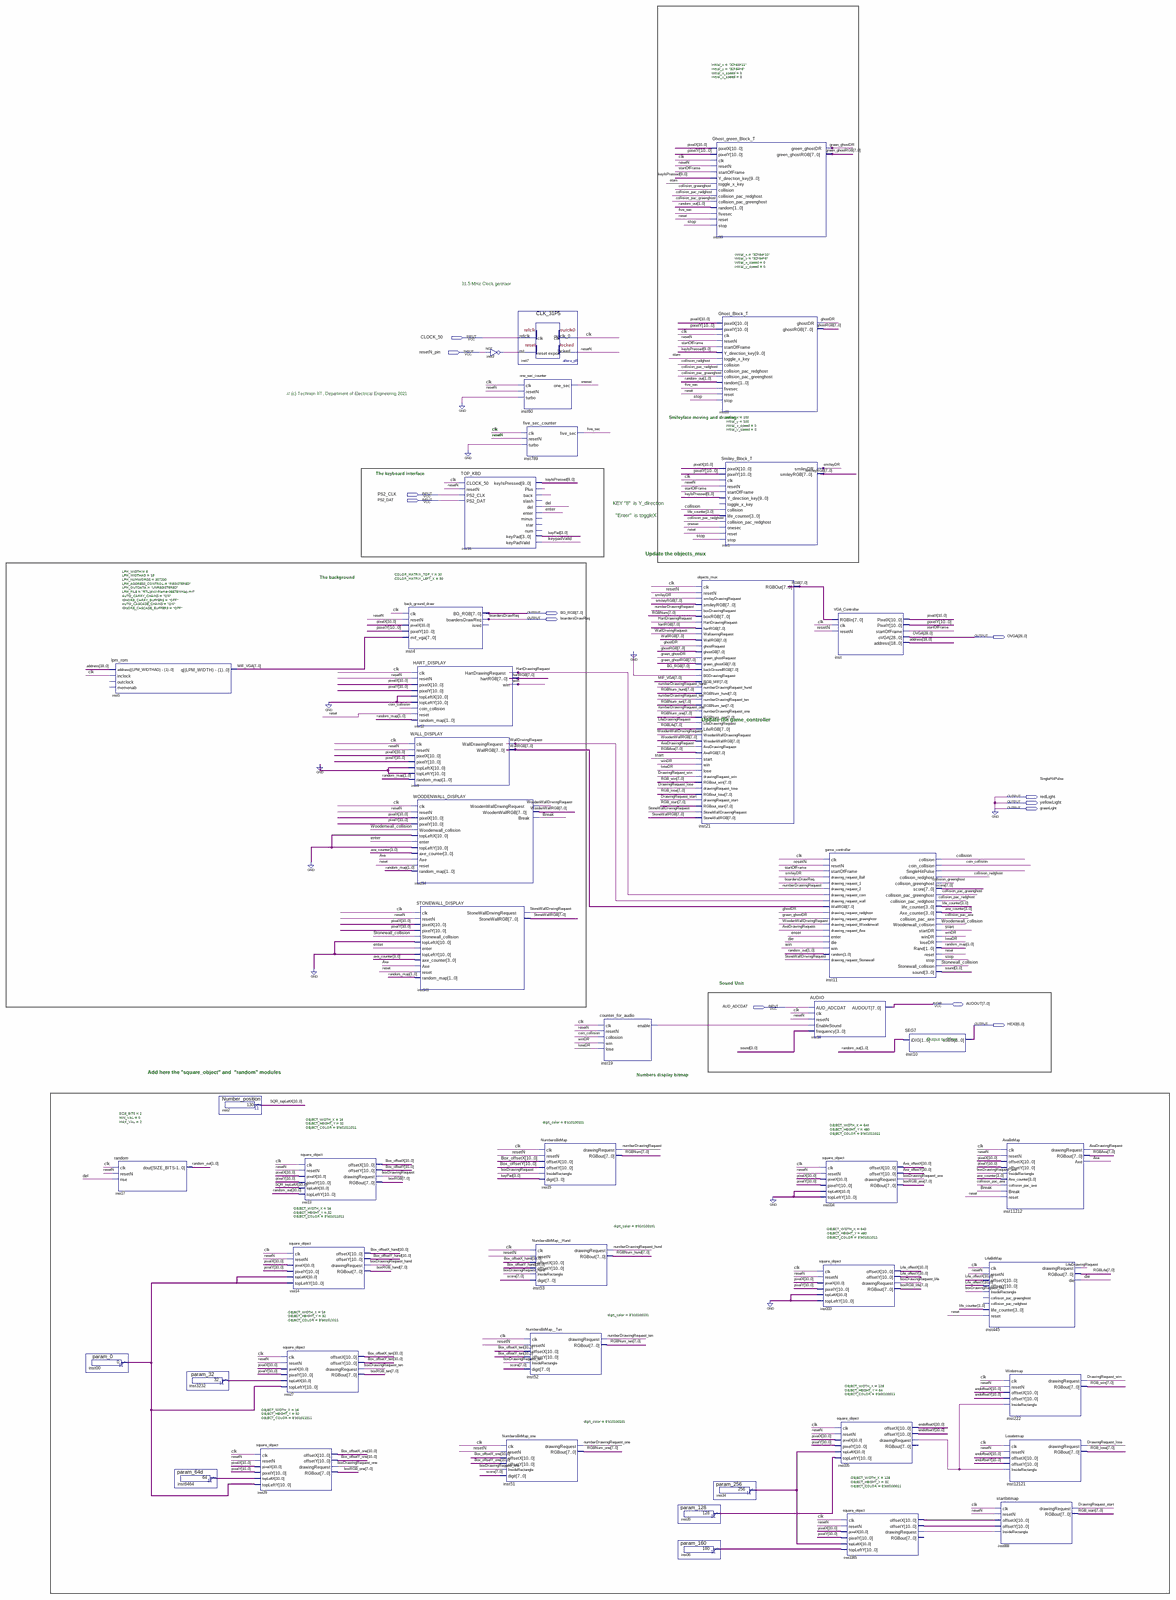
[diagram p0: schematic sheet, whole]
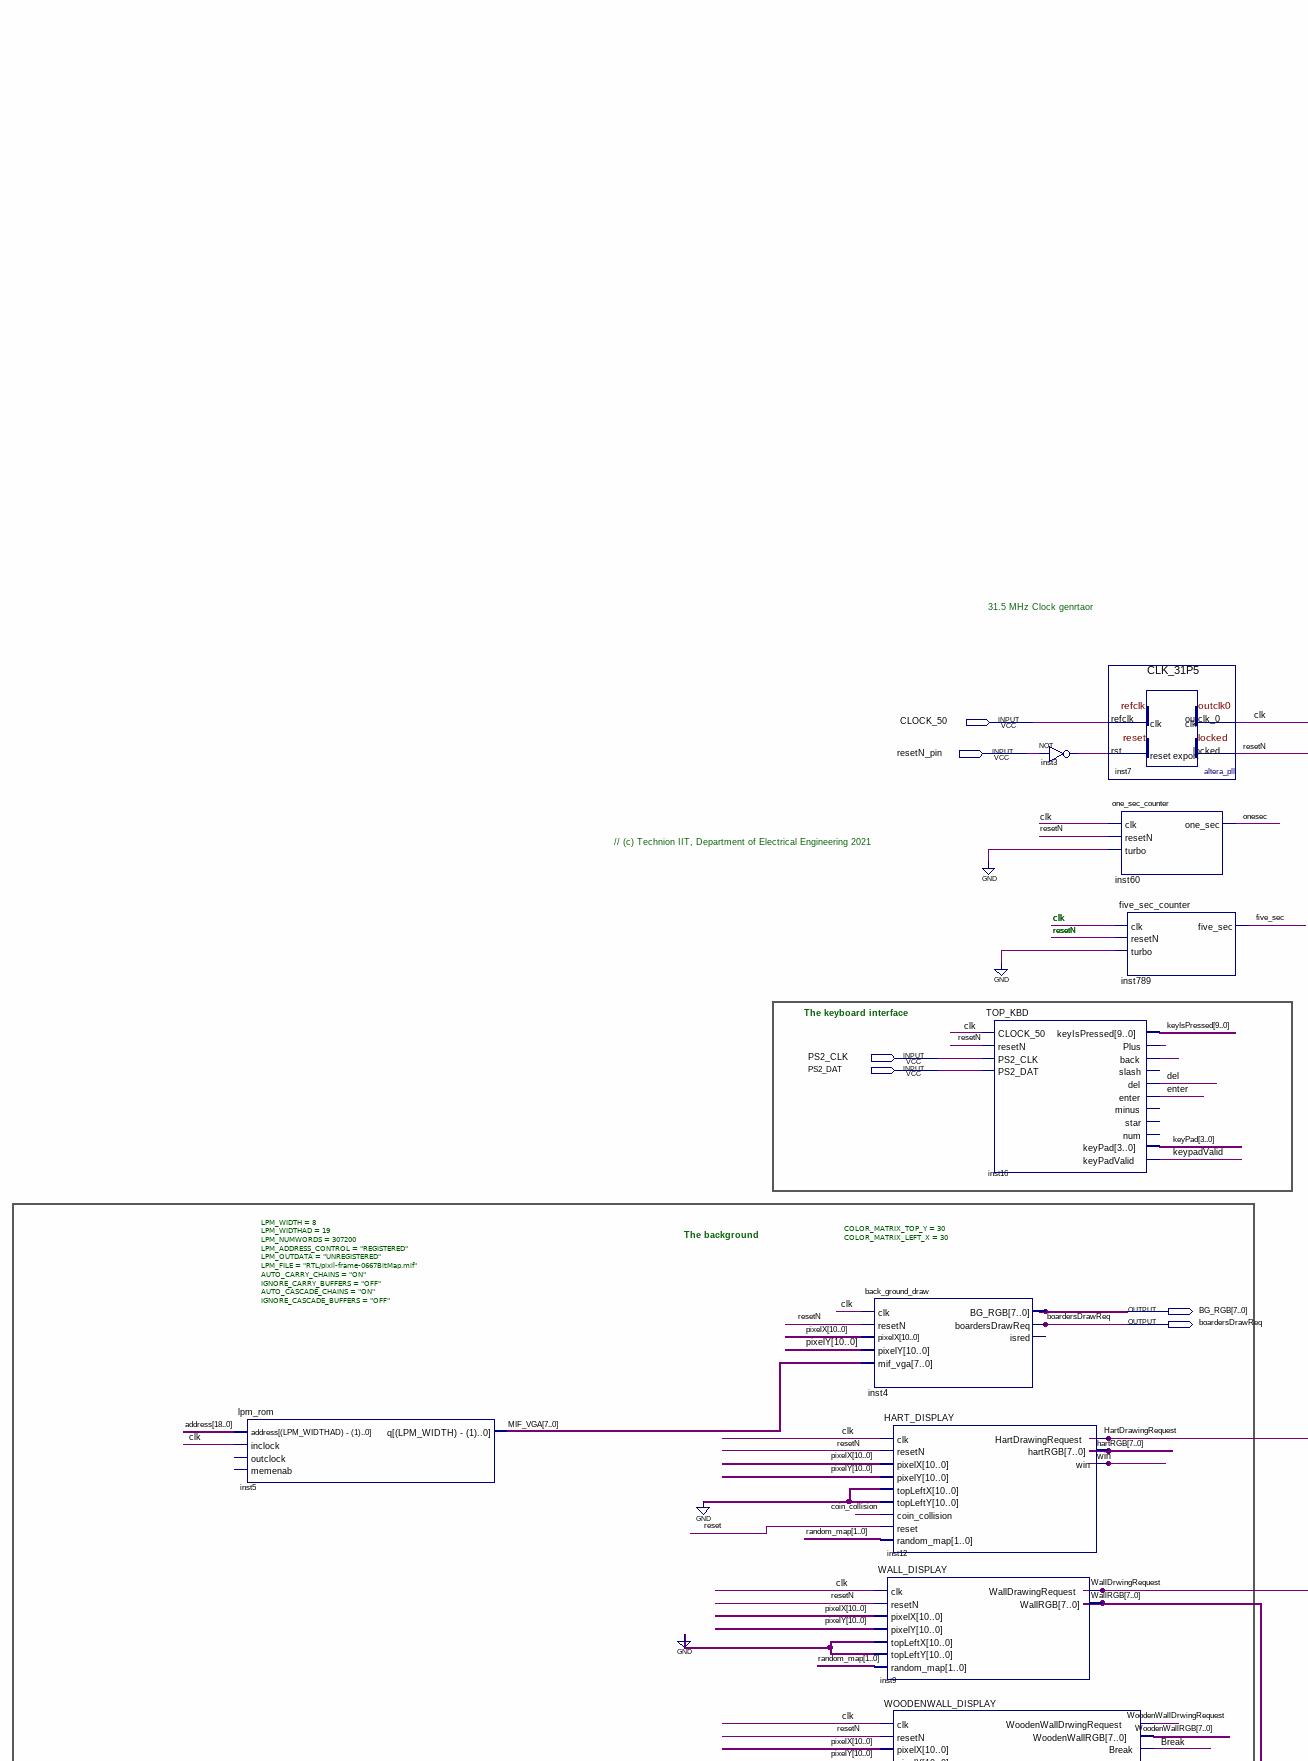
[diagram p1: schematic sheet, upper left part]
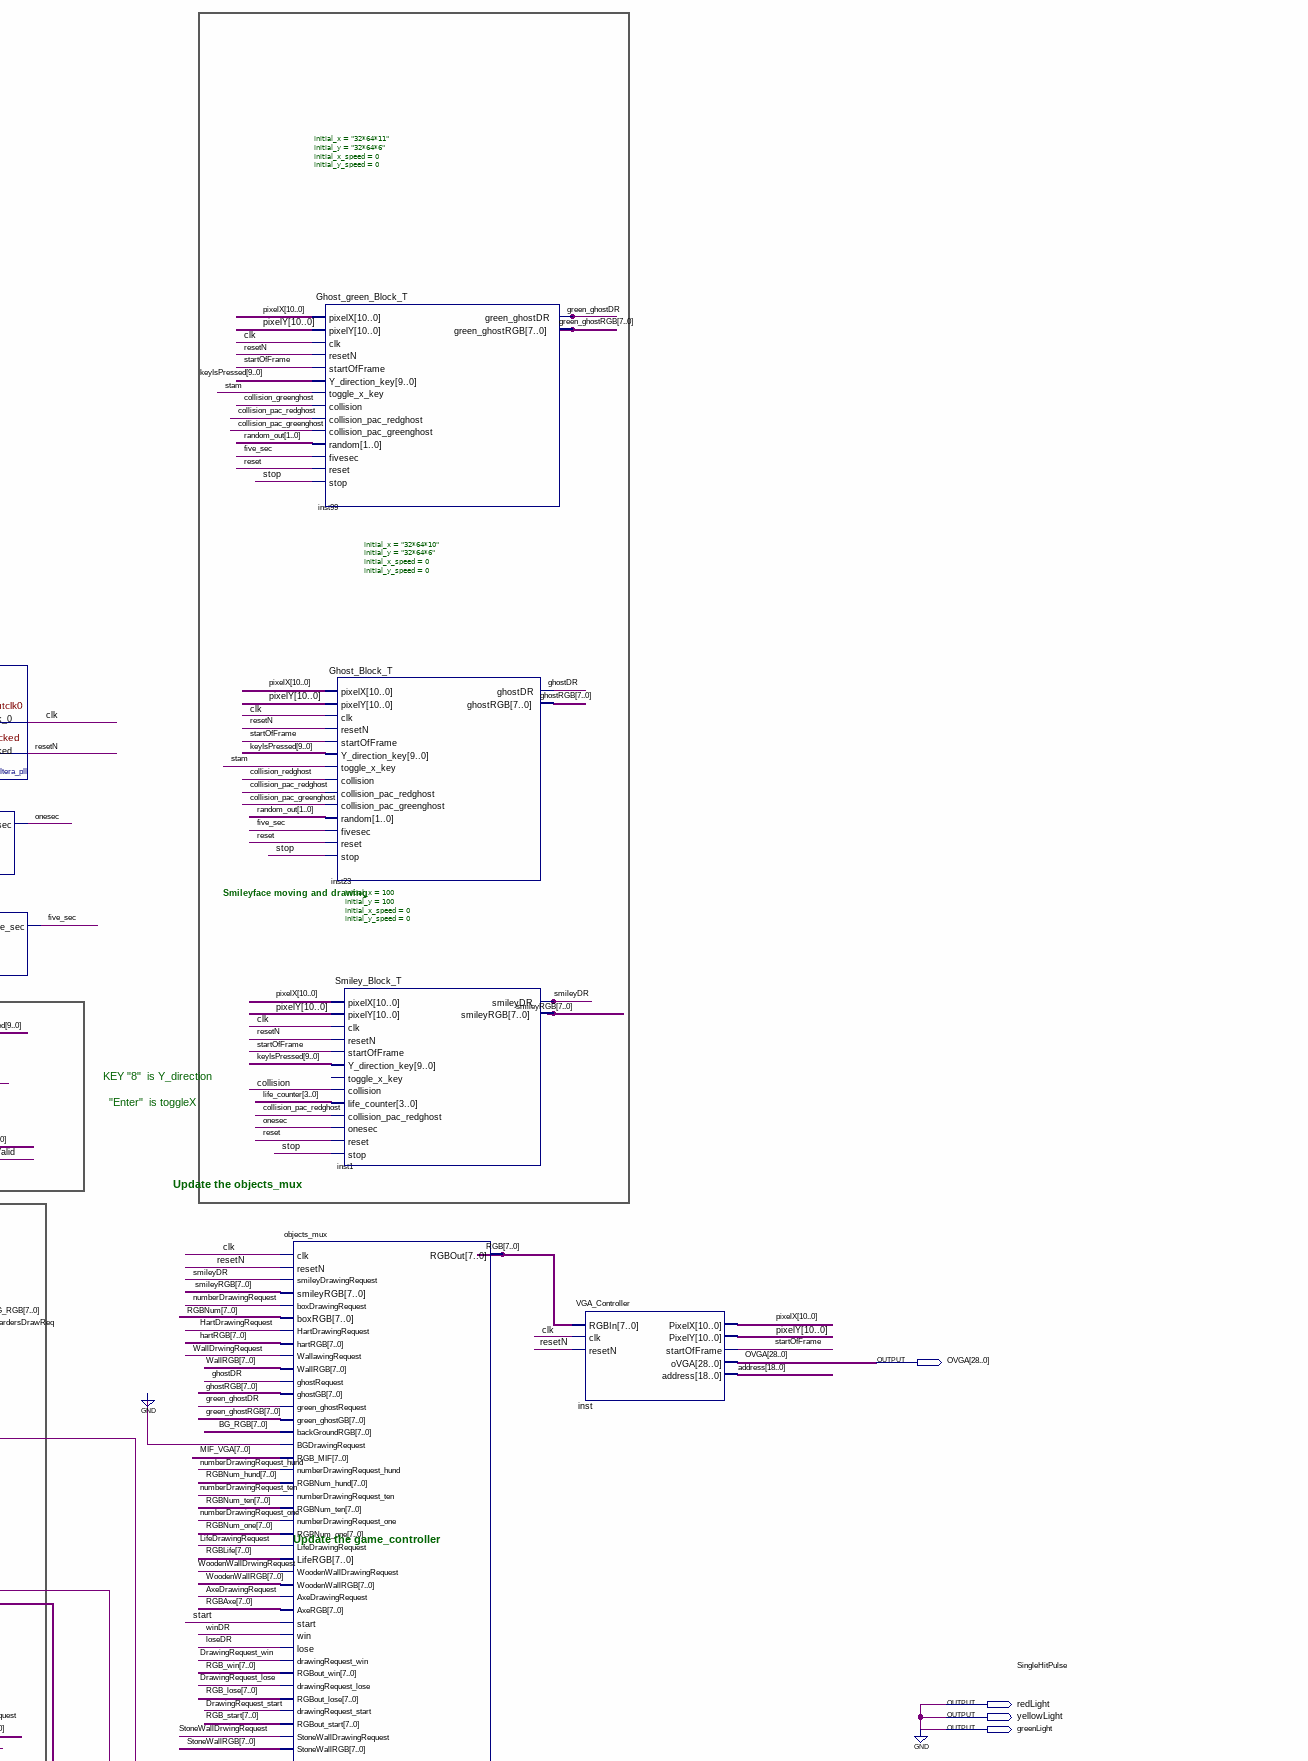
[diagram p2: schematic sheet, upper right part]
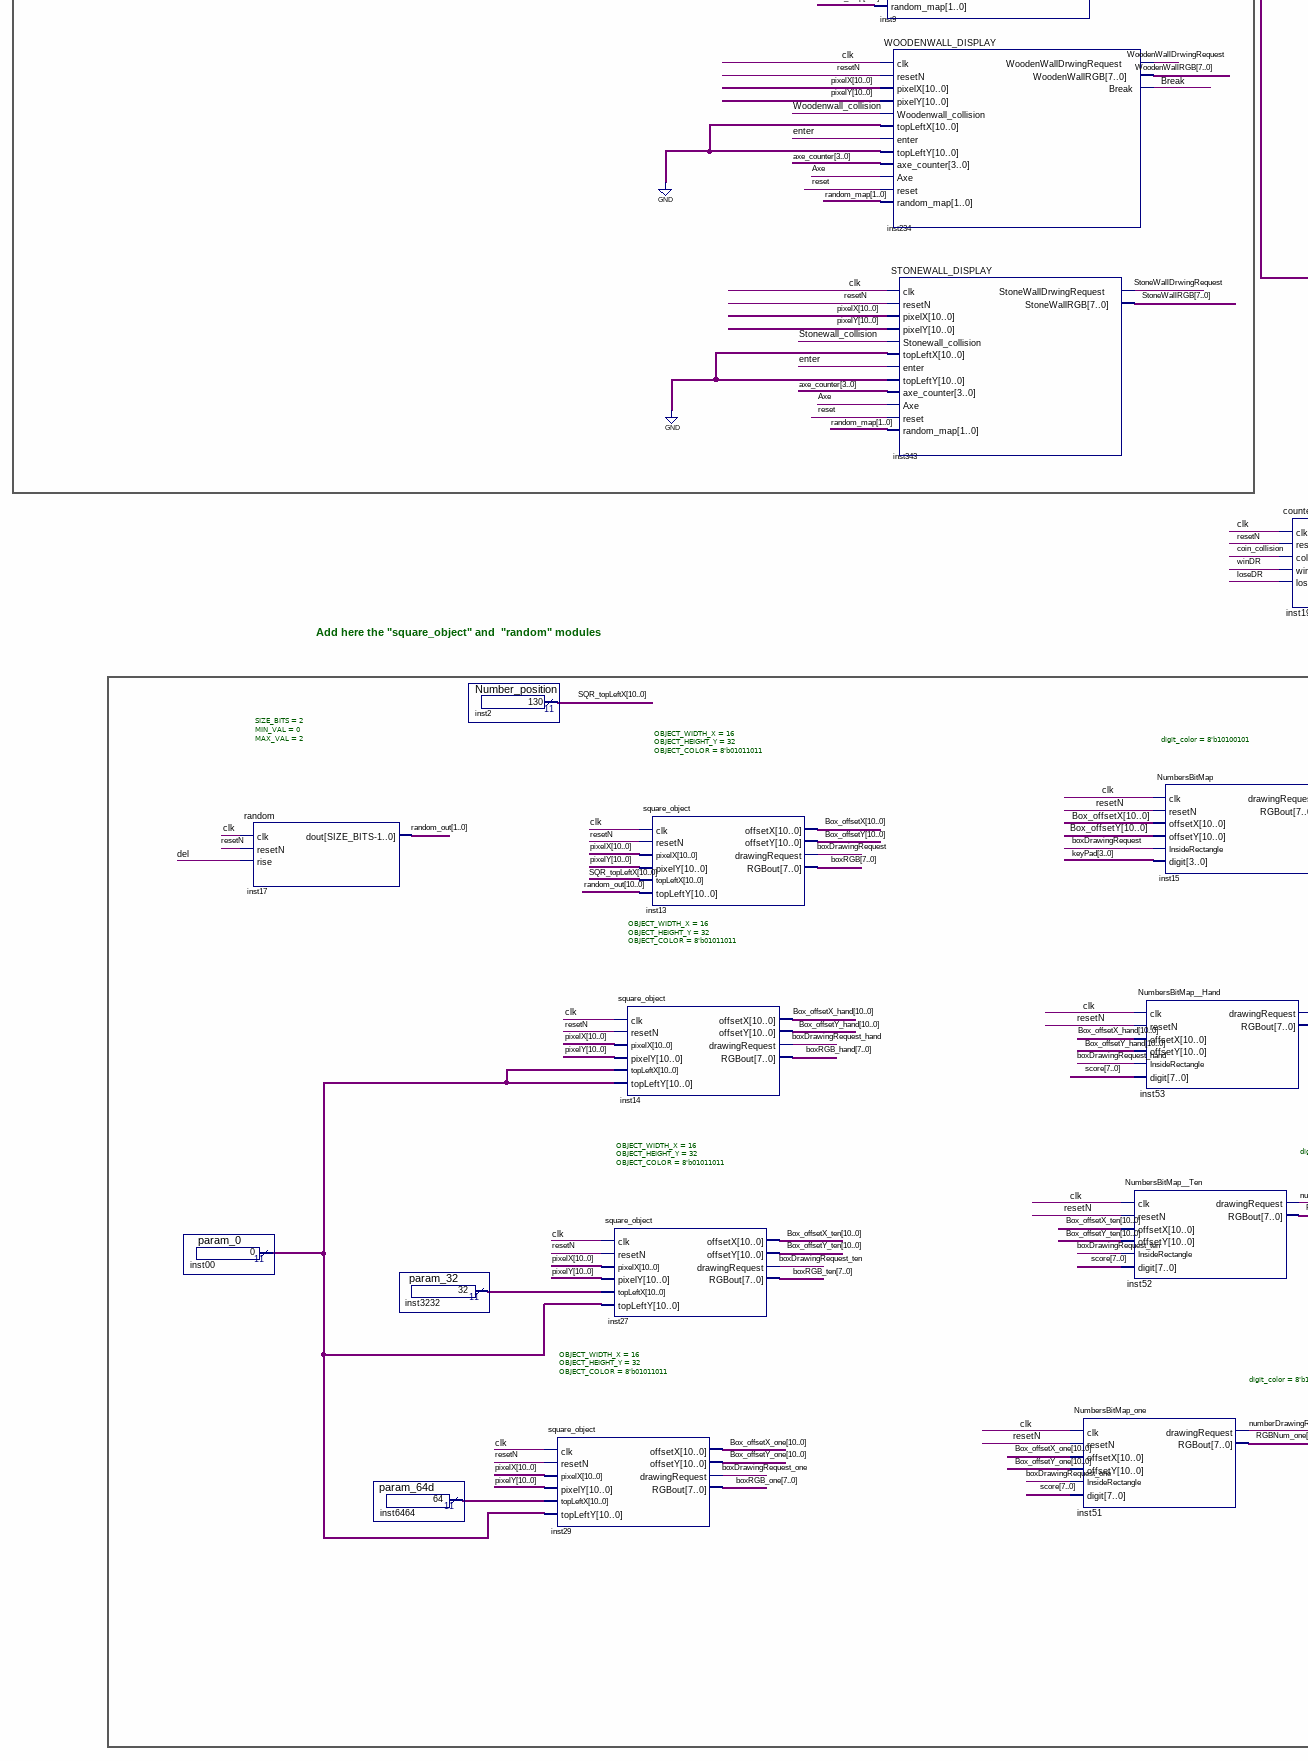
[diagram p3: schematic sheet, lower left part]
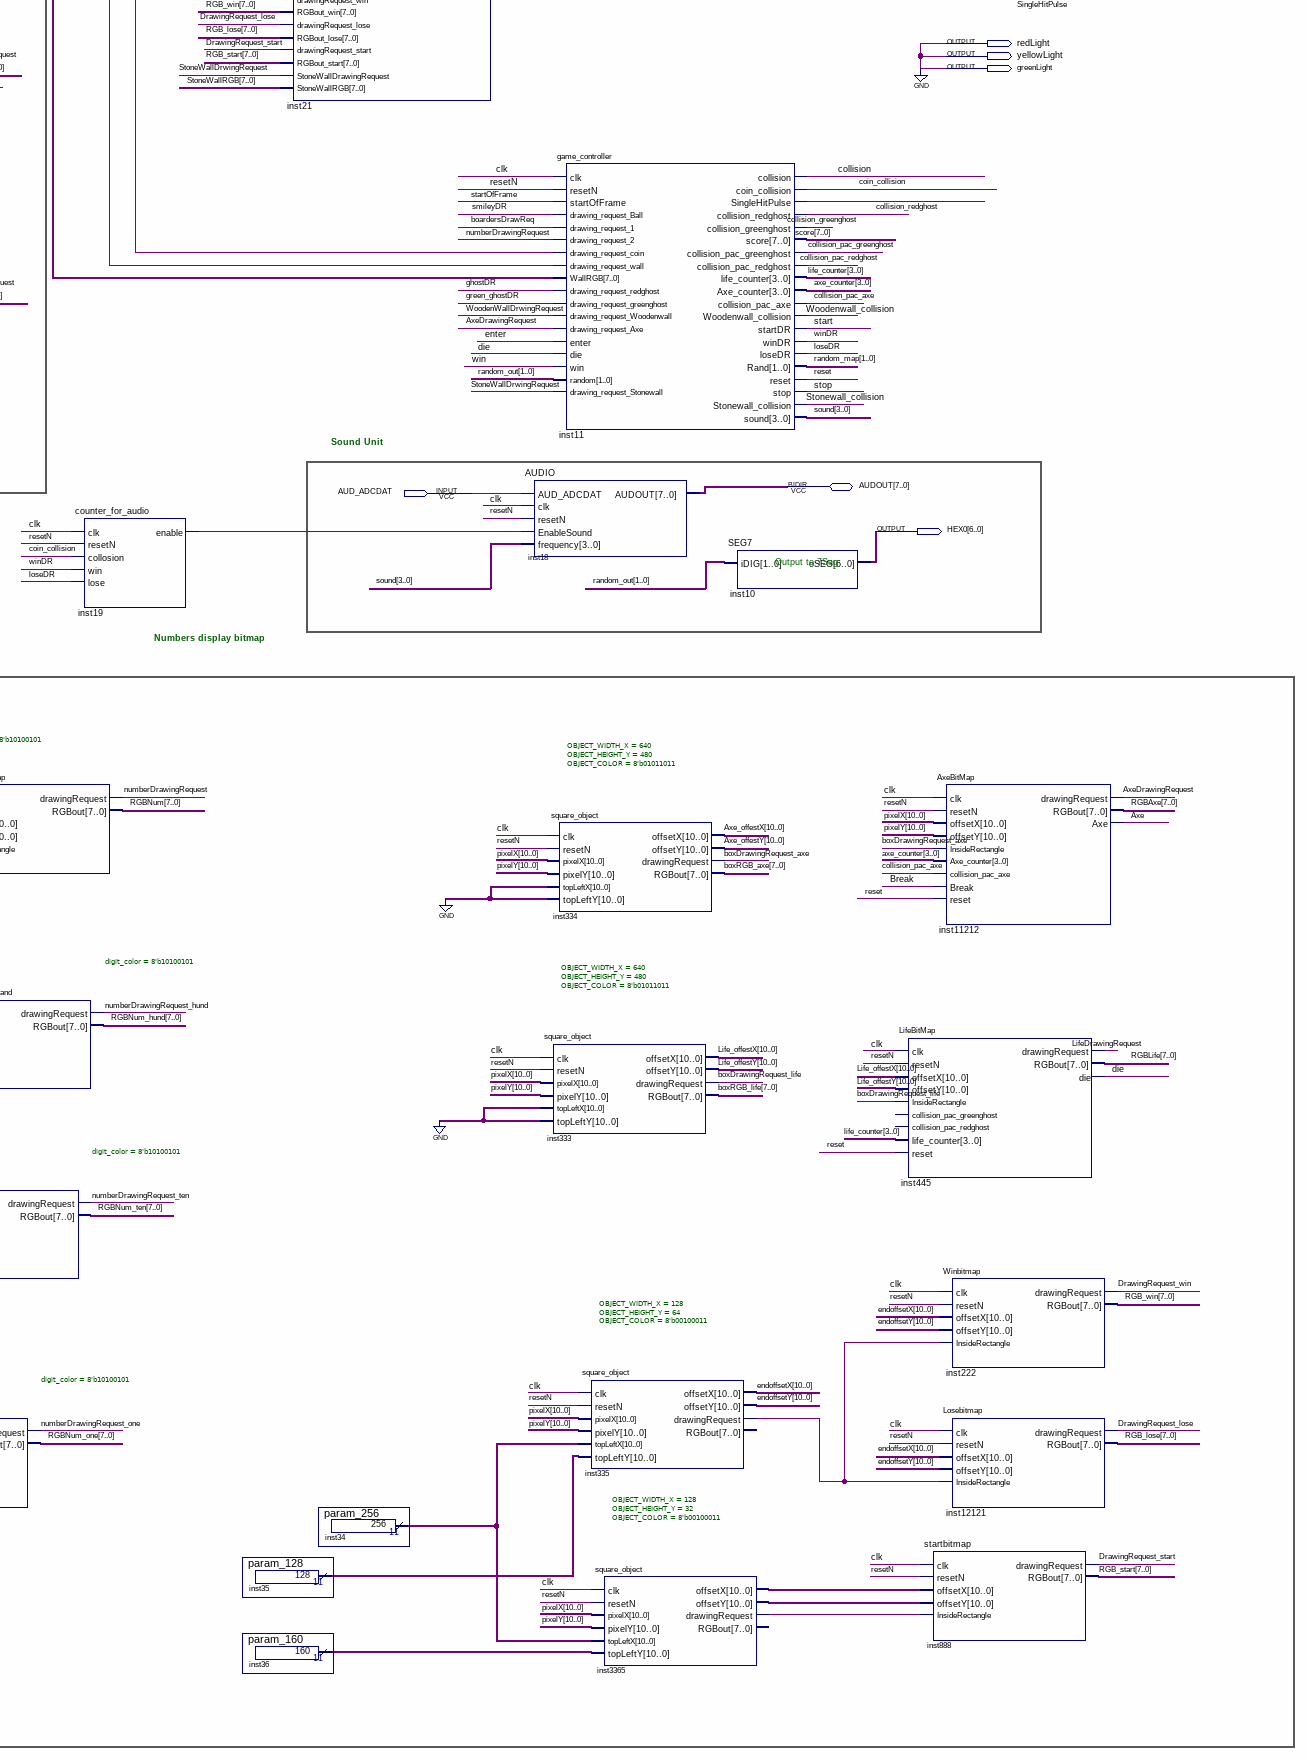
[diagram p4: schematic sheet, lower right part]
// Quartus schematic TOP_VGA_DEMO_KBD.bdf as structural Verilog: 45 symbols, 13 pins
module TOP_VGA_DEMO_KBD (
  input  CLOCK_50,
  input  resetN_pin,
  input  PS2_CLK,
  input  PS2_DAT,
  input  AUD_ADCDAT,
  inout  [7:0] AUDOUT,
  output [7:0] BG_RGB,
  output boardersDrawReq,
  output [28:0] OVGA,
  output redLight,
  output yellowLight,
  output greenLight,
  output [6:0] HEX0
);

  wire Axe, AxeDrawingRequest, boxDrawingRequest, boxDrawingRequest_axe, boxDrawingRequest_hand,
       boxDrawingRequest_life, boxDrawingRequest_one, boxDrawingRequest_ten, Break, clk, coin_collision,
       collision, collision_greenghost, collision_pac_axe, collision_pac_greenghost, collision_pac_redghost,
       collision_redghost, del, die, DrawingRequest_lose, DrawingRequest_start, DrawingRequest_win, enter,
       five_sec, ghostDR, green_ghostDR, HartDrawingRequest, inst3_out, inst16_back, inst16_plus,
       inst19_enable, inst335_drawingrequest, inst3365_drawingrequest, keypadValid, LifeDrawingRequest,
       loseDR, numberDrawingRequest, numberDrawingRequest_hund, numberDrawingRequest_one,
       numberDrawingRequest_ten, onesec, reset, resetN, SingleHitPulse, smileyDR, stam, start, startOfFrame,
       Stonewall_collision, StoneWallDrwingRequest, stop, WallDrwingRequest, win, winDR,
       Woodenwall_collision, WoodenWallDrwingRequest;
  wire [1:0] random_map;
  wire [3:0] axe_counter, keyPad, life_counter, sound;
  wire [7:0] boxRGB, boxRGB_axe, boxRGB_hand, boxRGB_life, boxRGB_one, boxRGB_ten, ghostRGB, green_ghostRGB,
       hartRGB, MIF_VGA, RGB, RGB_lose, RGB_start, RGB_win, RGBAxe, RGBLife, RGBNum, RGBNum_hund, RGBNum_one,
       RGBNum_ten, score, smileyRGB, StoneWallRGB, WallRGB, WoodenWallRGB;
  wire [9:0] keyIsPressed;
  wire [10:0] Axe_offestX, Axe_offestY, Box_offsetX, Box_offsetX_hand, Box_offsetX_one, Box_offsetX_ten,
       Box_offsetY, Box_offsetY_hand, Box_offsetY_one, Box_offsetY_ten, endoffsetX, endoffsetY,
       inst00_result, inst34_result, inst35_result, inst36_result, inst3232_result, inst3365_offsetx,
       inst3365_offsety, inst6464_result, Life_offestX, Life_offestY, pixelX, pixelY, random_out,
       SQR_topLeftX;
  wire [18:0] address;

  param_0 inst00 (.result(inst00_result));
  lpm_rom #(.LPM_WIDTH(8), .LPM_WIDTHAD(19), .LPM_NUMWORDS(307200), .LPM_ADDRESS_CONTROL("REGISTERED"), .LPM_OUTDATA("UNREGISTERED"), .LPM_FILE("RTL/pixil-frame-0667BitMap.mif"), .AUTO_CARRY_CHAINS("ON"), .IGNORE_CARRY_BUFFERS("OFF"), .AUTO_CASCADE_CHAINS("ON"), .IGNORE_CASCADE_BUFFERS("OFF")) inst5 (
    .address(address), .inclock(clk), .q(MIF_VGA));  // open: outclock, memenab
  random #(.SIZE_BITS(2), .MIN_VAL(0), .MAX_VAL(2)) inst17 (
    .clk(clk), .resetN(resetN), .rise(del), .dout(random_out[1:0]));
  param_32 inst3232 (.result(inst3232_result));
  param_64d inst6464 (.result(inst6464_result));
  Number_position inst2 (.result(SQR_topLeftX));
  square_object #(.OBJECT_WIDTH_X(16), .OBJECT_HEIGHT_Y(32), .OBJECT_COLOR(8'b01011011)) inst29 (
    .clk(clk), .resetN(resetN), .pixelX(pixelX), .pixelY(pixelY), .topLeftX(inst6464_result),
    .topLeftY(inst00_result), .offsetX(Box_offsetX_one), .offsetY(Box_offsetY_one),
    .drawingRequest(boxDrawingRequest_one), .RGBout(boxRGB_one));
  square_object #(.OBJECT_WIDTH_X(16), .OBJECT_HEIGHT_Y(32), .OBJECT_COLOR(8'b01011011)) inst27 (
    .clk(clk), .resetN(resetN), .pixelX(pixelX), .pixelY(pixelY), .topLeftX(inst3232_result),
    .topLeftY(inst00_result), .offsetX(Box_offsetX_ten), .offsetY(Box_offsetY_ten),
    .drawingRequest(boxDrawingRequest_ten), .RGBout(boxRGB_ten));
  square_object #(.OBJECT_WIDTH_X(16), .OBJECT_HEIGHT_Y(32), .OBJECT_COLOR(8'b01011011)) inst13 (
    .clk(clk), .resetN(resetN), .pixelX(pixelX), .pixelY(pixelY), .topLeftX(SQR_topLeftX),
    .topLeftY(random_out), .offsetX(Box_offsetX), .offsetY(Box_offsetY), .drawingRequest(boxDrawingRequest),
    .RGBout(boxRGB));
  square_object #(.OBJECT_WIDTH_X(16), .OBJECT_HEIGHT_Y(32), .OBJECT_COLOR(8'b01011011)) inst14 (
    .clk(clk), .resetN(resetN), .pixelX(pixelX), .pixelY(pixelY), .topLeftX(inst00_result),
    .topLeftY(inst00_result), .offsetX(Box_offsetX_hand), .offsetY(Box_offsetY_hand),
    .drawingRequest(boxDrawingRequest_hand), .RGBout(boxRGB_hand));
  back_ground_draw #(.COLOR_MATRIX_TOP_Y(30), .COLOR_MATRIX_LEFT_X(30)) inst4 (
    .clk(clk), .resetN(resetN), .pixelX(pixelX), .pixelY(pixelY), .mif_vga(MIF_VGA), .BG_RGB(BG_RGB),
    .boardersDrawReq(boardersDrawReq));  // open: isred
  HART_DISPLAY inst12 (
    .clk(clk), .resetN(resetN), .pixelX(pixelX), .pixelY(pixelY), .topLeftX({11{1'b0}}),
    .topLeftY({11{1'b0}}), .coin_collision(coin_collision), .reset(reset), .random_map(random_map),
    .HartDrawingRequest(HartDrawingRequest), .hartRGB(hartRGB), .win(win));
  WALL_DISPLAY inst9 (
    .clk(clk), .resetN(resetN), .pixelX(pixelX), .pixelY(pixelY), .topLeftX({11{1'b0}}),
    .topLeftY({11{1'b0}}), .random_map(random_map), .WallDrawingRequest(WallDrwingRequest), .WallRGB(WallRGB));
  WOODENWALL_DISPLAY inst234 (
    .clk(clk), .resetN(resetN), .pixelX(pixelX), .pixelY(pixelY),
    .Woodenwall_collision(Woodenwall_collision), .topLeftX({11{1'b0}}), .enter(enter), .topLeftY({11{1'b0}}),
    .axe_counter(axe_counter), .Axe(Axe), .reset(reset), .random_map(random_map),
    .WoodenWallDrwingRequest(WoodenWallDrwingRequest), .WoodenWallRGB(WoodenWallRGB), .Break(Break));
  STONEWALL_DISPLAY inst343 (
    .clk(clk), .resetN(resetN), .pixelX(pixelX), .pixelY(pixelY), .Stonewall_collision(Stonewall_collision),
    .topLeftX({11{1'b0}}), .enter(enter), .topLeftY({11{1'b0}}), .axe_counter(axe_counter), .Axe(Axe),
    .reset(reset), .random_map(random_map), .StoneWallDrwingRequest(StoneWallDrwingRequest),
    .StoneWallRGB(StoneWallRGB));
  TOP_KBD inst16 (
    .CLOCK_50(clk), .resetN(resetN), .PS2_CLK(PS2_CLK), .PS2_DAT(PS2_DAT), .keyIsPressed(keyIsPressed),
    .Plus(inst16_plus), .back(inst16_back), .del(del), .enter(enter), .keyPad(keyPad),
    .keyPadValid(keypadValid));  // open: slash, minus, star, num
  not inst3 (inst3_out, resetN_pin);
  CLK_31P5 inst7 (.refclk(CLOCK_50), .rst(inst3_out), .outclk_0(clk), .locked(resetN));
  one_sec_counter inst60 (.clk(clk), .resetN(resetN), .turbo(1'b0), .one_sec(onesec));
  NumbersBitMap_one #(.digit_color(8'b10100101)) inst51 (
    .clk(clk), .resetN(resetN), .offsetX(Box_offsetX_one), .offsetY(Box_offsetY_one),
    .InsideRectangle(boxDrawingRequest_one), .digit(score), .drawingRequest(numberDrawingRequest_one),
    .RGBout(RGBNum_one));
  five_sec_counter inst789 (.clk(clk), .resetN(resetN), .turbo(1'b0), .five_sec(five_sec));
  NumbersBitMap #(.digit_color(8'b10100101)) inst15 (
    .clk(clk), .resetN(resetN), .offsetX(Box_offsetX), .offsetY(Box_offsetY),
    .InsideRectangle(boxDrawingRequest), .digit(keyPad), .drawingRequest(numberDrawingRequest),
    .RGBout(RGBNum));
  NumbersBitMap__Hand #(.digit_color(8'b10100101)) inst53 (
    .clk(clk), .resetN(resetN), .offsetX(Box_offsetX_hand), .offsetY(Box_offsetY_hand),
    .InsideRectangle(boxDrawingRequest_hand), .digit(score), .drawingRequest(numberDrawingRequest_hund),
    .RGBout(RGBNum_hund));
  NumbersBitMap__Ten #(.digit_color(8'b10100101)) inst52 (
    .clk(clk), .resetN(resetN), .offsetX(Box_offsetX_ten), .offsetY(Box_offsetY_ten),
    .InsideRectangle(boxDrawingRequest_ten), .digit(score), .drawingRequest(numberDrawingRequest_ten),
    .RGBout(RGBNum_ten));
  counter_for_audio inst19 (
    .clk(clk), .resetN(resetN), .collosion(coin_collision), .win(winDR), .lose(loseDR), .enable(inst19_enable));
  param_128 inst35 (.result(inst35_result));
  param_160 inst36 (.result(inst36_result));
  objects_mux inst21 (
    .clk(clk), .resetN(resetN), .smileyDrawingRequest(smileyDR), .smileyRGB(smileyRGB),
    .boxDrawingRequest(numberDrawingRequest), .boxRGB(RGBNum), .HartDrawingRequest(HartDrawingRequest),
    .hartRGB(hartRGB), .WallawingRequest(WallDrwingRequest), .WallRGB(WallRGB), .ghostRequest(ghostDR),
    .ghostGB(ghostRGB), .green_ghostRequest(green_ghostDR), .green_ghostGB(green_ghostRGB),
    .backGroundRGB(BG_RGB), .BGDrawingRequest(1'b0), .RGB_MIF(MIF_VGA),
    .numberDrawingRequest_hund(numberDrawingRequest_hund), .RGBNum_hund(RGBNum_hund),
    .numberDrawingRequest_ten(numberDrawingRequest_ten), .RGBNum_ten(RGBNum_ten),
    .numberDrawingRequest_one(numberDrawingRequest_one), .RGBNum_one(RGBNum_one),
    .LifeDrawingRequest(LifeDrawingRequest), .LifeRGB(RGBLife),
    .WoodenWallDrawingRequest(WoodenWallDrwingRequest), .WoodenWallRGB(WoodenWallRGB),
    .AxeDrawingRequest(AxeDrawingRequest), .AxeRGB(RGBAxe), .start(start), .win(winDR), .lose(loseDR),
    .drawingRequest_win(DrawingRequest_win), .RGBout_win(RGB_win), .drawingRequest_lose(DrawingRequest_lose),
    .RGBout_lose(RGB_lose), .drawingRequest_start(DrawingRequest_start), .RGBout_start(RGB_start),
    .StoneWallDrawingRequest(StoneWallDrwingRequest), .StoneWallRGB(StoneWallRGB), .RGBOut(RGB));
  Ghost_green_Block_T #(.initial_x("32*64*11"), .initial_y("32*64*6"), .initial_x_speed(0), .initial_y_speed(0)) inst99 (
    .pixelX(pixelX), .pixelY(pixelY), .clk(clk), .resetN(resetN), .startOfFrame(startOfFrame),
    .Y_direction_key(keyIsPressed), .toggle_x_key(stam), .collision(collision_greenghost),
    .collision_pac_redghost(collision_pac_redghost), .collision_pac_greenghost(collision_pac_greenghost),
    .random(random_out[1:0]), .fivesec(five_sec), .reset(reset), .stop(stop), .green_ghostDR(green_ghostDR),
    .green_ghostRGB(green_ghostRGB));
  Ghost_Block_T #(.initial_x("32*64*10"), .initial_y("32*64*6"), .initial_x_speed(0), .initial_y_speed(0)) inst23 (
    .pixelX(pixelX), .pixelY(pixelY), .clk(clk), .resetN(resetN), .startOfFrame(startOfFrame),
    .Y_direction_key(keyIsPressed), .toggle_x_key(stam), .collision(collision_redghost),
    .collision_pac_redghost(collision_pac_redghost), .collision_pac_greenghost(collision_pac_greenghost),
    .random(random_out[1:0]), .fivesec(five_sec), .reset(reset), .stop(stop), .ghostDR(ghostDR),
    .ghostRGB(ghostRGB));
  Smiley_Block_T #(.initial_x(100), .initial_y(100), .initial_x_speed(0), .initial_y_speed(0)) inst1 (
    .pixelX(pixelX), .pixelY(pixelY), .clk(clk), .resetN(resetN), .startOfFrame(startOfFrame),
    .Y_direction_key(keyIsPressed), .collision(collision), .life_counter(life_counter),
    .collision_pac_redghost(collision_pac_redghost), .onesec(onesec), .reset(reset), .stop(stop),
    .smileyDR(smileyDR), .smileyRGB(smileyRGB));  // open: toggle_x_key
  param_256 inst34 (.result(inst34_result));
  game_controller inst11 (
    .clk(clk), .resetN(resetN), .startOfFrame(startOfFrame), .drawing_request_Ball(smileyDR),
    .drawing_request_1(boardersDrawReq), .drawing_request_2(numberDrawingRequest),
    .drawing_request_coin(HartDrawingRequest), .drawing_request_wall(WallDrwingRequest), .WallRGB(WallRGB),
    .drawing_request_redghost(ghostDR), .drawing_request_greenghost(green_ghostDR),
    .drawing_request_Woodenwall(WoodenWallDrwingRequest), .drawing_request_Axe(AxeDrawingRequest),
    .enter(enter), .die(die), .win(win), .random(random_out[1:0]),
    .drawing_request_Stonewall(StoneWallDrwingRequest), .collision(collision),
    .coin_collision(coin_collision), .SingleHitPulse(SingleHitPulse),
    .collision_redghost(collision_redghost), .collision_greenghost(collision_greenghost), .score(score),
    .collision_pac_greenghost(collision_pac_greenghost), .collision_pac_redghost(collision_pac_redghost),
    .life_counter(life_counter), .Axe_counter(axe_counter), .collision_pac_axe(collision_pac_axe),
    .Woodenwall_collision(Woodenwall_collision), .startDR(start), .winDR(winDR), .loseDR(loseDR),
    .Rand(random_map), .reset(reset), .stop(stop), .Stonewall_collision(Stonewall_collision), .sound(sound));
  AUDIO inst18 (
    .AUD_ADCDAT(AUD_ADCDAT), .clk(clk), .resetN(resetN), .EnableSound(inst19_enable), .frequency(sound),
    .AUDOUT(AUDOUT));
  square_object #(.OBJECT_WIDTH_X(640), .OBJECT_HEIGHT_Y(480), .OBJECT_COLOR(8'b01011011)) inst334 (
    .clk(clk), .resetN(resetN), .pixelX(pixelX), .pixelY(pixelY), .topLeftX({11{1'b0}}),
    .topLeftY({11{1'b0}}), .offsetX(Axe_offestX), .offsetY(Axe_offestY),
    .drawingRequest(boxDrawingRequest_axe), .RGBout(boxRGB_axe));
  square_object #(.OBJECT_WIDTH_X(640), .OBJECT_HEIGHT_Y(480), .OBJECT_COLOR(8'b01011011)) inst333 (
    .clk(clk), .resetN(resetN), .pixelX(pixelX), .pixelY(pixelY), .topLeftX({11{1'b0}}),
    .topLeftY({11{1'b0}}), .offsetX(Life_offestX), .offsetY(Life_offestY),
    .drawingRequest(boxDrawingRequest_life), .RGBout(boxRGB_life));
  VGA_Controller inst (
    .RGBIn(RGB), .clk(clk), .resetN(resetN), .PixelX(pixelX), .PixelY(pixelY), .startOfFrame(startOfFrame),
    .oVGA(OVGA), .address(address));
  square_object #(.OBJECT_WIDTH_X(128), .OBJECT_HEIGHT_Y(64), .OBJECT_COLOR(8'b00100011)) inst335 (
    .clk(clk), .resetN(resetN), .pixelX(pixelX), .pixelY(pixelY), .topLeftX(inst34_result),
    .topLeftY(inst35_result), .offsetX(endoffsetX), .offsetY(endoffsetY),
    .drawingRequest(inst335_drawingrequest));  // open: RGBout
  square_object #(.OBJECT_WIDTH_X(128), .OBJECT_HEIGHT_Y(32), .OBJECT_COLOR(8'b00100011)) inst3365 (
    .clk(clk), .resetN(resetN), .pixelX(pixelX), .pixelY(pixelY), .topLeftX(inst34_result),
    .topLeftY(inst36_result), .offsetX(inst3365_offsetx), .offsetY(inst3365_offsety),
    .drawingRequest(inst3365_drawingrequest));  // open: RGBout
  SEG7 inst10 (.iDIG(random_out[1:0]), .oSEG(HEX0));
  LifeBitMap inst445 (
    .clk(clk), .resetN(resetN), .offsetX(Life_offestX), .offsetY(Life_offestY),
    .InsideRectangle(boxDrawingRequest_life), .life_counter(life_counter), .reset(reset),
    .drawingRequest(LifeDrawingRequest), .RGBout(RGBLife), .die(die));  // open: collision_pac_greenghost, collision_pac_redghost
  AxeBitMap inst11212 (
    .clk(clk), .resetN(resetN), .offsetX(pixelX), .offsetY(pixelY), .InsideRectangle(boxDrawingRequest_axe),
    .Axe_counter(axe_counter), .collision_pac_axe(collision_pac_axe), .Break(Break), .reset(reset),
    .drawingRequest(AxeDrawingRequest), .RGBout(RGBAxe), .Axe(Axe));
  Winbitmap inst222 (
    .clk(clk), .resetN(resetN), .offsetX(endoffsetX), .offsetY(endoffsetY),
    .InsideRectangle(inst335_drawingrequest), .drawingRequest(DrawingRequest_win), .RGBout(RGB_win));
  Losebitmap inst12121 (
    .clk(clk), .resetN(resetN), .offsetX(endoffsetX), .offsetY(endoffsetY),
    .InsideRectangle(inst335_drawingrequest), .drawingRequest(DrawingRequest_lose), .RGBout(RGB_lose));
  startbitmap inst888 (
    .clk(clk), .resetN(resetN), .offsetX(inst3365_offsetx), .offsetY(inst3365_offsety),
    .InsideRectangle(inst3365_drawingrequest), .drawingRequest(DrawingRequest_start), .RGBout(RGB_start));

  assign greenLight = 1'b0;
  assign redLight = 1'b0;
  assign yellowLight = 1'b0;

  // Notes on the sheet:
  //   31.5 MHz Clock genrtaor
  //   // (c) Technion IIT, Department of Electrical Engineering 2021
  //   Smileyface moving and drawing
  //   clk
  //   resetN
  //   The keyboard interface
  //   KEY "8"  is Y_direction
  //   "Enter"  is toggleX
  //   Update the objects_mux
  //   The background
  //   Update the game_controller
  //   Sound Unit
  //   Output to 7Seg
  //   Add here the "square_object" and  "random" modules
  //   Numbers display bitmap
endmodule
